# EAGLE design Multiplier (EAGLE 7.2.0)
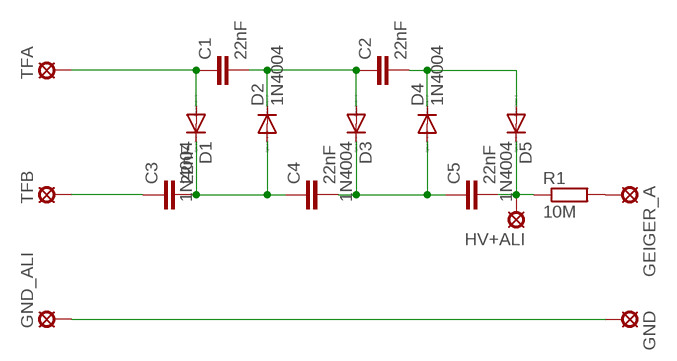
[diagram p0: schematic, sheet 1]

## Parts
C1  22nF  C-EU025_050-025X075  [C025_050-025X075]
C2  22nF  C-EU025_050-025X075  [C025_050-025X075]
C3  22nF  C-EU025_050-025X075  [C025_050-025X075]
C4  22nF  C-EU025_050-025X075  [C025_050-025X075]
C5  22nF  C-EU025_050-025X075  [C025_050-025X075]
D1  1N4004  [DO41-10]
D2  1N4004  [DO41-10]
D3  1N4004  [DO41-10]
D4  1N4004  [DO41-10]
D5  1N4004  [DO41-10]
GEIGER_A  LSP10  [LSP10]
GND  LSP10  [LSP10]
GND_ALI  LSP10  [LSP10]
HV+ALI  LSP10  [LSP10]
R1  10M  R-EU_0309/10  [0309/10]
TFA  LSP10  [LSP10]
TFB  LSP10  [LSP10]

## Nets
N$1: C3.2 C4.1 D1.C D2.A
N$2: C4.2 C5.1 D3.C D4.A
N$3: C5.2 D5.C HV+ALI.MP R1.1
N$4: C2.2 D4.C D5.A
N$5: C1.2 C2.1 D2.C D3.A
N$6: C1.1 D1.A TFA.MP
N$7: C3.1 TFB.MP
N$8: GEIGER_A.MP R1.2
N$9: GND.MP GND_ALI.MP

## Library data of the parts
C1-C5 = rcl:C-EU: CAPACITOR, European symbol
D1-D5 = diode:1N4004: DIODE general purpose rectifier, 1 A
GEIGER_A GND GND_ALI HV+ALI TFA TFB = solpad:LSP10: SOLDER PAD drill 1.0 mm, distributor Buerklin, 12H555
R1 = rcl:R-EU_: RESISTOR, European symbol

## Board
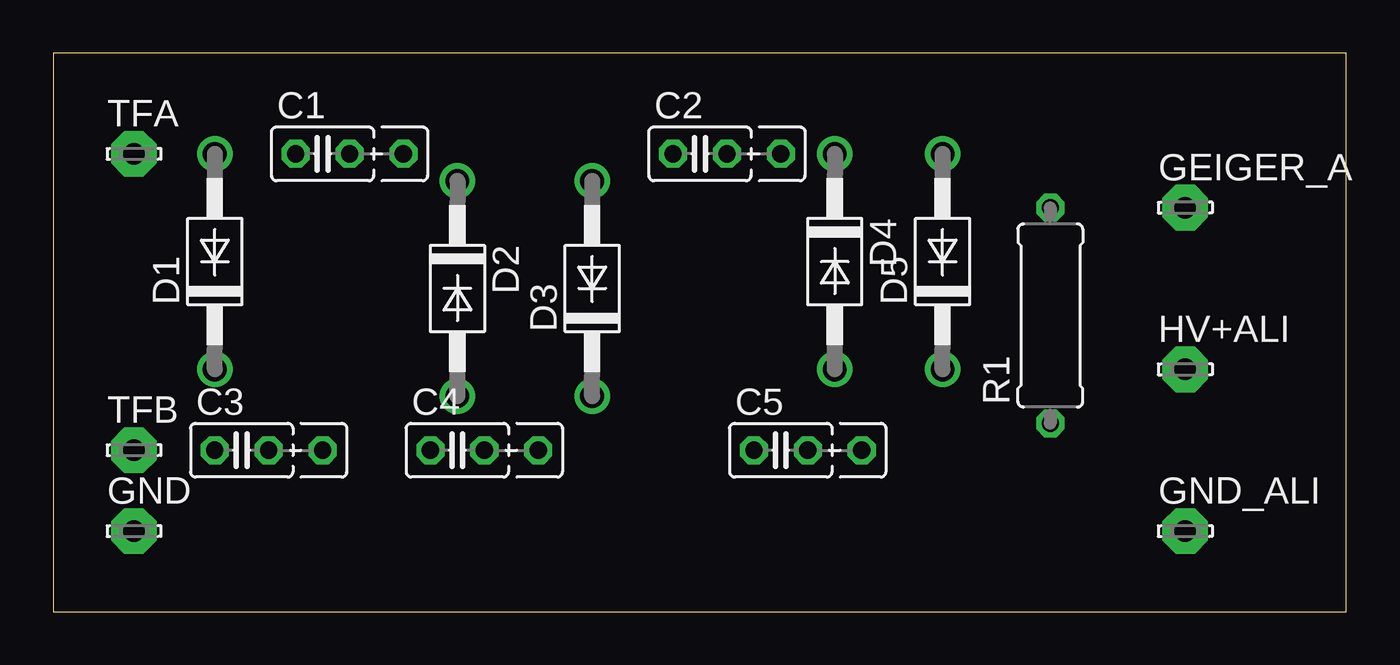
[diagram p1: board, top side]
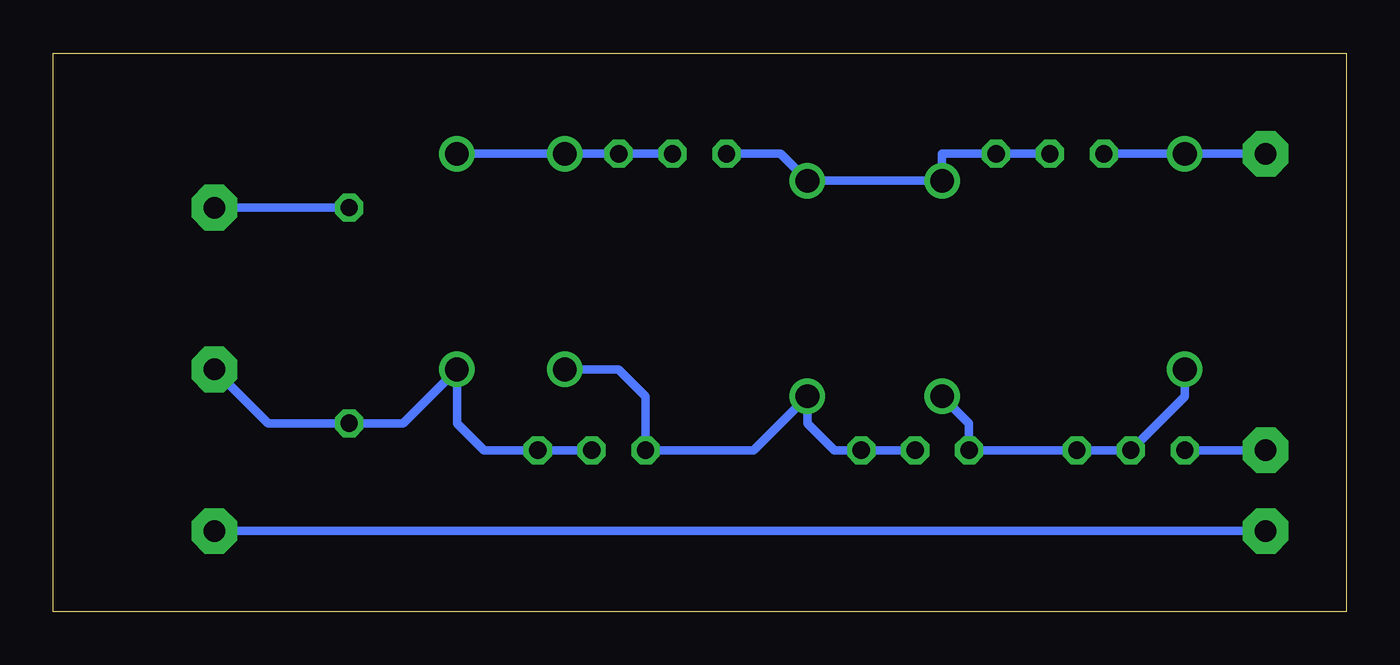
[diagram p2: board, bottom side, seen from below]

Size 60.94 x 26.34 mm. Coordinates in mm from the lower left corner, seen from the top.
Outline: 0,0 60.94,0 60.94,26.34 0,26.34 0,0
Copper layers (1*16): Top 0.035mm / dielectric 1.5mm / Bottom 0.035mm
Design rules "default": minimum track width 10mil, minimum drill 24mil, track to track 8mil, track to pad 8mil, pad to pad 8mil, via to via 8mil, smd to smd 8mil, copper to edge 40mil, drill to drill 8mil, minimum pad ring 10mil, minimum via ring 8mil, stop-mask expansion 4mil, vias tented up to drill 0mil, thermal gap 10mil

### Footprints (pad centres in the part's own frame; a part is rotated, then mirrored left to right if it is on the bottom)
C025_050-025X075 = drill 0.813 octagon: 1 -1.27,0; 2 1.27,0; 3 3.81,0
DO41-10 = drill 1.118: A 5.08,0; C -5.08,0
LSP10 = drill 1.016 pad 2.159 octagon: MP 0,0
0309/10 = drill 0.813 octagon: 1 -5.08,0; 2 5.08,0

### Placement (x,y rotation side)
C1  12.7,21.59 0 top
C2  30.48,21.59 0 top
C3  8.89,7.62 0 top
C4  19.05,7.62 0 top
C5  34.29,7.62 0 top
D1  7.62,16.51 90 top
D2  19.05,15.24 270 top
D3  25.4,15.24 90 top
D4  36.83,16.51 270 top
D5  41.91,16.51 90 top
GEIGER_A  53.34,19.05 0 top
GND  3.81,3.81 0 top
GND_ALI  53.34,3.81 0 top
HV+ALI  53.34,11.43 0 top
R1  46.99,13.97 90 top
TFA  3.81,21.59 0 top
TFB  3.81,7.62 0 top

### Tracks (layer width: path | path; a pad name or v marks a point on that pad's centre or on a via)
N$1
  Bottom 0.406: D2.A 17.78,8.89 C4.1 C3.2 7.62,10.16 D1.C
N$2
  Bottom 0.406: D4.A 34.29,11.43 33.02,10.16 C5.1 27.94,7.62 D3.C 25.4,8.89 24.13,7.62 C4.2
N$3
  Bottom 0.406: HV+ALI.MP 50.8,8.89 R1.1 44.45,8.89 D5.C 41.91,8.89 40.64,7.62 C5.2
N$4
  Bottom 0.406: D5.A D4.C C2.2
N$5
  Bottom 0.406: C2.1 26.67,21.59 D3.A D2.C 19.05,21.59 C1.2
N$6
  Bottom 0.406: TFA.MP D1.A C1.1
N$7
  Bottom 0.406: TFB.MP C3.1
N$8
  Bottom 0.406: R1.2 GEIGER_A.MP
N$9
  Bottom 0.406: GND.MP GND_ALI.MP